# EAGLE schematic m404 (EAGLE 8.2.1)
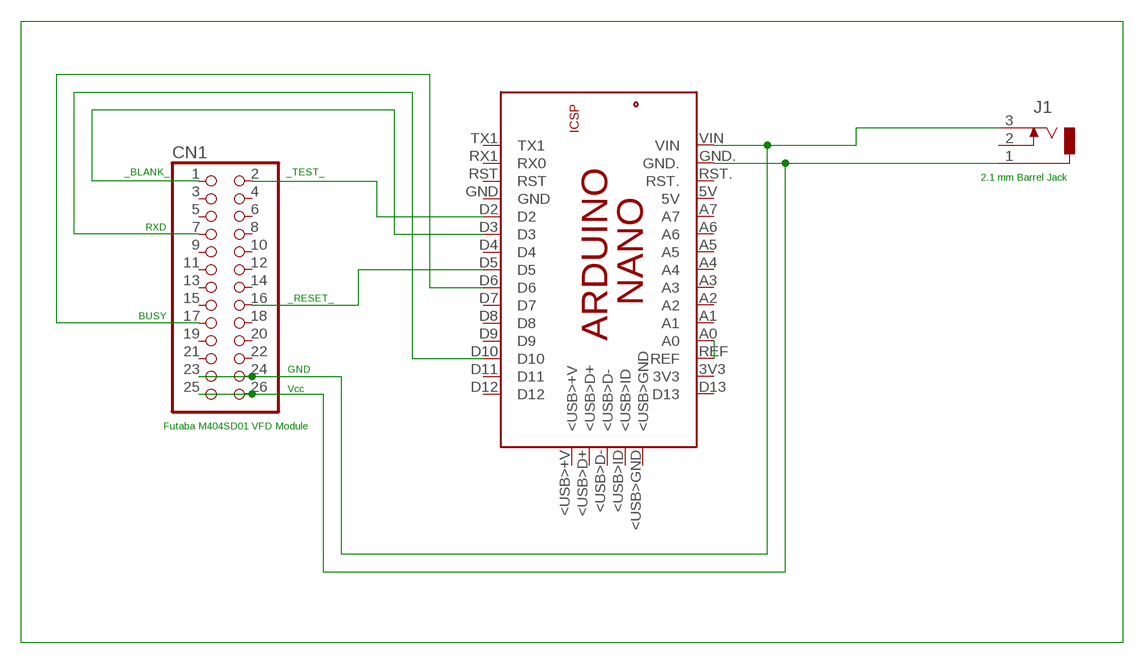
[diagram p0: schematic, sheet 1]

## Parts
CN1  PINHD-2X13  [2X13]
J1  DCJ0202  [DCJ0202]
PCB1  ARDUINO_NANO  [ARDUINO_NANO]

## Nets
N$1: CN1.25 CN1.26 J1.1 PCB1.GND.
N$2: CN1.1 PCB1.D3
N$3: CN1.23 CN1.24 J1.3 PCB1.VIN
N$4: PCB1.A0 PCB1.REF
N$5: CN1.2 PCB1.D2
N$6: CN1.7 PCB1.D10
N$7: CN1.16 PCB1.D5
N$8: CN1.17 PCB1.D6
Unconnected: CN1.3 CN1.4 CN1.5 CN1.6 CN1.8 CN1.9 CN1.10 CN1.11 CN1.12 CN1.13 CN1.14 CN1.15 CN1.18 CN1.19 CN1.20 CN1.21 CN1.22 J1.2 PCB1.3V3 PCB1.5V PCB1.5V. PCB1.<USB>+V PCB1.<USB>D+ PCB1.<USB>D- PCB1.<USB>GND PCB1.<USB>ID PCB1.A1 PCB1.A2 PCB1.A3 PCB1.A4 PCB1.A5 PCB1.A6 PCB1.A7 PCB1.D4 PCB1.D7 PCB1.D8 PCB1.D9 PCB1.D11 PCB1.D12 PCB1.D13 PCB1.GND PCB1.GND_ PCB1.MISO PCB1.MOSI PCB1.RESET.. PCB1.RST PCB1.RST. PCB1.RX1(RX0) PCB1.SCK PCB1.TX1

## Notes on the sheet
- _BLANK_ | _TEST_
- 2.1 mm Barrel Jack
- RXD
- _RESET_
- BUSY
- GND
- Vcc
- Futaba M404SD01 VFD Module

## Library data of the parts
CN1 = pinhead:PINHD-2X13: PIN HEADER
J1 = con-jack:DCJ0202: DC POWER JACK Source: DCJ0202.pdf; OC_FARNELL: unknown; OC_NEWARK: unknown
PCB1 = E14_Arduino_revC:ARDUINO_NANO: Device for representing an Arduino Nano board with a footprint in an EAGLE design. Created by Dave Young for Element14. More EAGLE documentation at: http://www.element14.com/community/community/knode/cadsoft_eagle